# Altium schematic sheet Microcontroller and Memory.SCHDOC
size A3; SheetNumber: 1; SheetTotal: 5
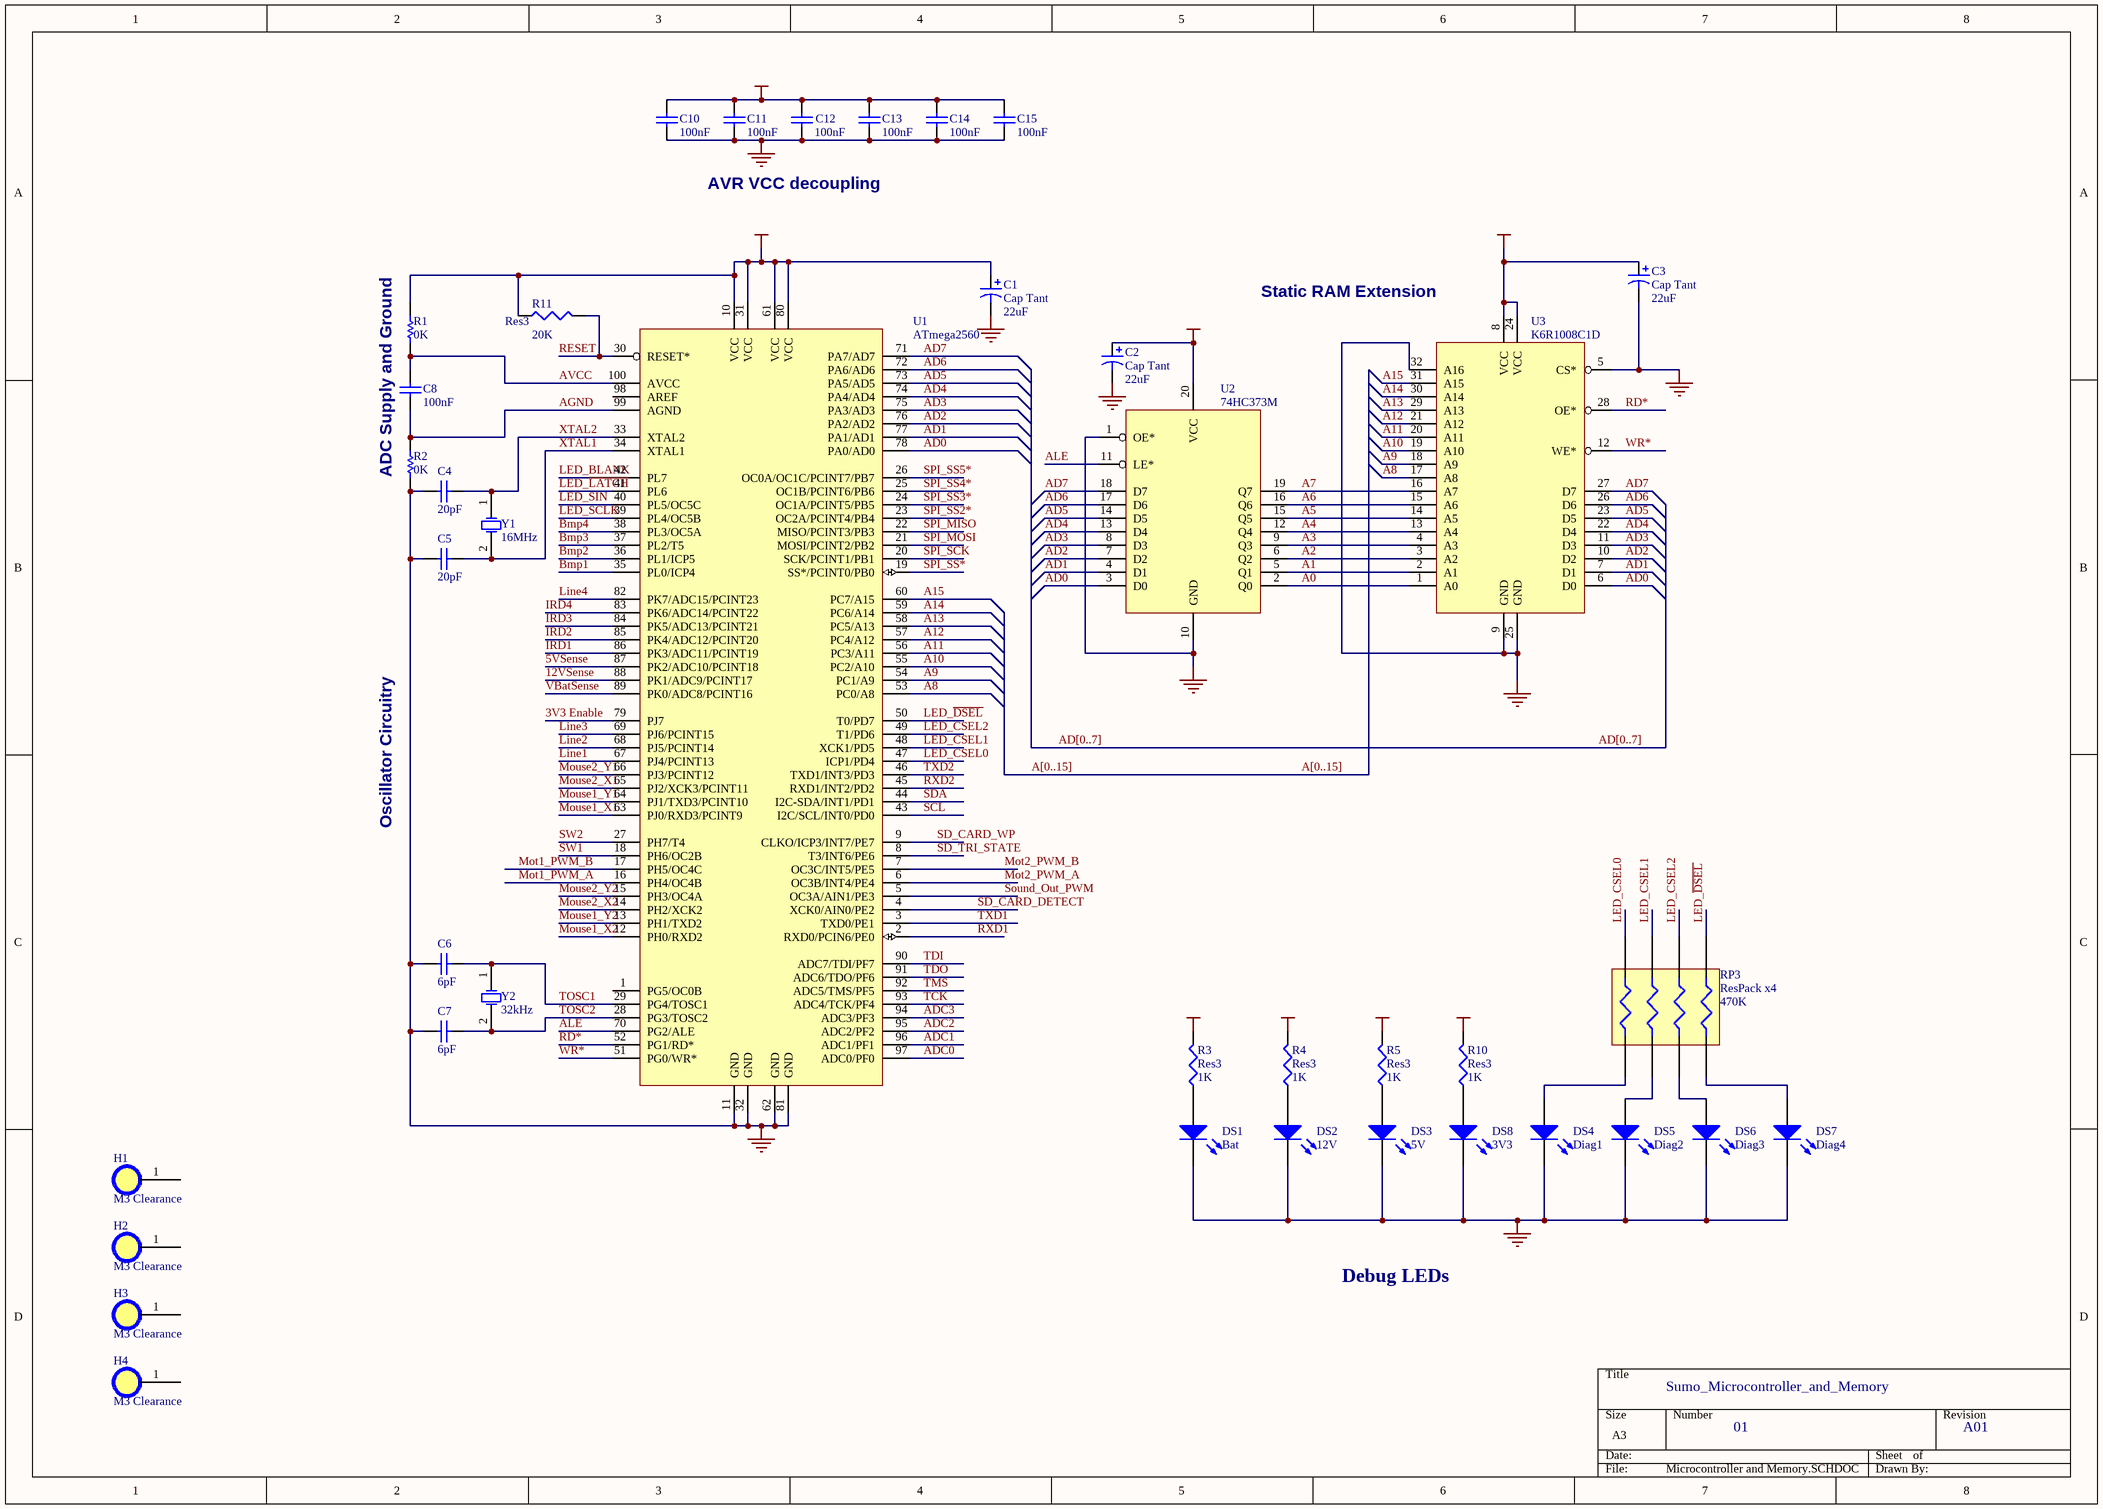
[diagram p0: Microcontroller and Memory.SCHDOC]

## Parts
C1  Cap Tant  value 22uF  [CC4532-1812]
C2  Cap Tant  value 22uF  [CC4532-1812]
C3  Cap Tant  value 22uF  [CC4532-1812]
C4  20pF  [CC2012-0805]
C5  20pF  [CC2012-0805]
C6  6pF  [CC2012-0805]
C7  6pF  [CC2012-0805]
C8  100nF  [CC2012-0805]
C10  value 100nF  [CC2012-0805]  (hidden comment: Cap Semi)
C11  value 100nF  [CC2012-0805]  (hidden comment: Cap Semi)
C12  value 100nF  [CC2012-0805]  (hidden comment: Cap Semi)
C13  value 100nF  [CC2012-0805]  (hidden comment: Cap Semi)
C14  value 100nF  [CC2012-0805]  (hidden comment: Cap Semi)
C15  value 100nF  [CC2012-0805]  (hidden comment: Cap Semi)
DS1  Bat  [SMD _LED]
DS2  12V  [SMD _LED]
DS3  5V  [SMD _LED]
DS4  Diag1  [SMD _LED]
DS5  Diag2  [SMD _LED]
DS6  Diag3  [SMD _LED]
DS7  Diag4  [SMD _LED]
DS8  3V3  [SMD _LED]
H1  M3 Clearance  [M3 Clearance]
H2  M3 Clearance  [M3 Clearance]
H3  M3 Clearance  [M3 Clearance]
H4  M3 Clearance  [M3 Clearance]
R1  0K  [R2012-0805]
R2  0K  [R2012-0805]
R3  Res3  value 1K  [R2012-0805]
R4  Res3  value 1K  [R2012-0805]
R5  Res3  value 1K  [R2012-0805]
R10  Res3  value 1K  [R2012-0805]
R11  Res3  value 20K  [R2012-0805]
RP3  ResPack x4  value 470K  [4x0805 Resistor pack]
U1  ATmega2560  [F-QFP14X14-G100/Z17N]
U2  74HC373M  [SO-G20/Y1.45]
U3  K6R1008C1D  [SO-G32/Y1.45]
Y1  16MHz  [Crystal HC49SLF]
Y2  32kHz  [Crystal CFS206]

## Nets
3V3: R10.2
5V: C1.1 C2.1 C3.1 C10.2 C11.2 C12.2 C13.2 C14.2 C15.2 R1.2 R5.2 R11.1 U1.10(VCC) U1.31(VCC) U1.61(VCC) U1.80(VCC) U2.20(VCC) U3.8(VCC) U3.24(VCC)
12V: R4.2
GND: C1.2 C2.2 C3.2 C4.1 C5.1 C6.1 C7.1 C10.1 C11.1 C12.1 C13.1 C14.1 C15.1 DS1.2(K) DS2.2(K) DS3.2(K) DS4.2(K) DS5.2(K) DS6.2(K) DS7.2(K) DS8.2(K) R2.1 U1.11(GND) U1.32(GND) U1.62(GND) U1.81(GND) U2.1(OE*) U2.10(GND) U3.5(CS*) U3.9(GND) U3.25(GND) U3.32(A16)
VBat: R3.2
3V3 Enable: U1.79(PJ7)
5VSense: U1.87(PK2/ADC10/PCINT18)
12VSense: U1.88(PK1/ADC9/PCINT17)
A0: U2.2(Q0) U3.1(A0)
A1: U2.5(Q1) U3.2(A1)
A2: U2.6(Q2) U3.3(A2)
A3: U2.9(Q3) U3.4(A3)
A4: U2.12(Q4) U3.13(A4)
A5: U2.15(Q5) U3.14(A5)
A6: U2.16(Q6) U3.15(A6)
A7: U2.19(Q7) U3.16(A7)
A8: U1.53(PC0/A8) U3.17(A8)
A9: U1.54(PC1/A9) U3.18(A9)
A10: U1.55(PC2/A10) U3.19(A10)
A11: U1.56(PC3/A11) U3.20(A11)
A12: U1.57(PC4/A12) U3.21(A12)
A13: U1.58(PC5/A13) U3.29(A13)
A14: U1.59(PC6/A14) U3.30(A14)
A15: U1.60(PC7/A15) U3.31(A15)
AD0: U1.78(PA0/AD0) U2.3(D0) U3.6(D0)
AD1: U1.77(PA1/AD1) U2.4(D1) U3.7(D1)
AD2: U1.76(PA2/AD2) U2.7(D2) U3.10(D2)
AD3: U1.75(PA3/AD3) U2.8(D3) U3.11(D3)
AD4: U1.74(PA4/AD4) U2.13(D4) U3.22(D4)
AD5: U1.73(PA5/AD5) U2.14(D5) U3.23(D5)
AD6: U1.72(PA6/AD6) U2.17(D6) U3.26(D6)
AD7: U1.71(PA7/AD7) U2.18(D7) U3.27(D7)
ADC0: U1.97(ADC0/PF0)
ADC1: U1.96(ADC1/PF1)
ADC2: U1.95(ADC2/PF2)
ADC3: U1.94(ADC3/PF3)
AGND: C8.2 R2.2 U1.99(AGND)
ALE: U1.70(PG2/ALE) U2.11(LE*)
AVCC: C8.1 R1.1 U1.100(AVCC)
Bmp1: U1.35(PL0/ICP4)
Bmp2: U1.36(PL1/ICP5)
Bmp3: U1.37(PL2/T5)
Bmp4: U1.38(PL3/OC5A)
IRD1: U1.86(PK3/ADC11/PCINT19)
IRD2: U1.85(PK4/ADC12/PCINT20)
IRD3: U1.84(PK5/ADC13/PCINT21)
IRD4: U1.83(PK6/ADC14/PCINT22)
LED_BLANK: U1.42(PL7)
LED_CSEL0: RP3.8 U1.47(ICP1/PD4)
LED_CSEL1: RP3.7 U1.48(XCK1/PD5)
LED_CSEL2: RP3.6 U1.49(T1/PD6)
LED_~{DSEL}: RP3.5 U1.50(T0/PD7)
LED_~{LATCH}: U1.41(PL6)
LED_SCLK: U1.39(PL4/OC5B)
LED_SIN: U1.40(PL5/OC5C)
Line1: U1.67(PJ4/PCINT13)
Line2: U1.68(PJ5/PCINT14)
Line3: U1.69(PJ6/PCINT15)
Line4: U1.82(PK7/ADC15/PCINT23)
Mot1_PWM_A: U1.16(PH4/OC4B)
Mot1_PWM_B: U1.17(PH5/OC4C)
Mot2_PWM_A: U1.6(OC3B/INT4/PE4)
Mot2_PWM_B: U1.7(OC3C/INT5/PE5)
Mouse1_X1: U1.63(PJ0/RXD3/PCINT9)
Mouse1_X2: U1.12(PH0/RXD2)
Mouse1_Y1: U1.64(PJ1/TXD3/PCINT10)
Mouse1_Y2: U1.13(PH1/TXD2)
Mouse2_X1: U1.65(PJ2/XCK3/PCINT11)
Mouse2_X2: U1.14(PH2/XCK2)
Mouse2_Y1: U1.66(PJ3/PCINT12)
Mouse2_Y2: U1.15(PH3/OC4A)
RD*: U1.52(PG1/RD*) U3.28(OE*)
RESET: R11.2 U1.30(RESET*)
RXD1: U1.2(RXD0/PCIN6/PE0)
RXD2: U1.45(RXD1/INT2/PD2)
SCL: U1.43(I2C/SCL/INT0/PD0)
SD_CARD_DETECT: U1.4(XCK0/AIN0/PE2)
SD_CARD_WP: U1.9(CLKO/ICP3/INT7/PE7)
SD_TRI_STATE: U1.8(T3/INT6/PE6)
SDA: U1.44(I2C-SDA/INT1/PD1)
Sound_Out_PWM: U1.5(OC3A/AIN1/PE3)
SPI_MISO: U1.22(MISO/PCINT3/PB3)
SPI_MOSI: U1.21(MOSI/PCINT2/PB2)
SPI_SCK: U1.20(SCK/PCINT1/PB1)
SPI_SS2*: U1.23(OC2A/PCINT4/PB4)
SPI_SS3*: U1.24(OC1A/PCINT5/PB5)
SPI_SS4*: U1.25(OC1B/PCINT6/PB6)
SPI_SS5*: U1.26(OC0A/OC1C/PCINT7/PB7)
SPI_SS*: U1.19(SS*/PCINT0/PB0)
SW1: U1.18(PH6/OC2B)
SW2: U1.27(PH7/T4)
TCK: U1.93(ADC4/TCK/PF4)
TDI: U1.90(ADC7/TDI/PF7)
TDO: U1.91(ADC6/TDO/PF6)
TMS: U1.92(ADC5/TMS/PF5)
TOSC1: C6.2 U1.29(PG4/TOSC1) Y2.1(OSC1)
TOSC2: C7.2 U1.28(PG3/TOSC2) Y2.2(OSC2)
TXD1: U1.3(TXD0/PE1)
TXD2: U1.46(TXD1/INT3/PD3)
VBatSense: U1.89(PK0/ADC8/PCINT16)
WR*: U1.51(PG0/WR*) U3.12(WE*)
XTAL1: C5.2 U1.34(XTAL1) Y1.2(OSC2)
XTAL2: C4.2 U1.33(XTAL2) Y1.1(OSC1)
NetDS1_1: DS1.1(A) R3.1
NetDS2_1: DS2.1(A) R4.1
NetDS3_1: DS3.1(A) R5.1
NetDS4_1: DS4.1(A) RP3.1
NetDS5_1: DS5.1(A) RP3.2
NetDS6_1: DS6.1(A) RP3.3
NetDS7_1: DS7.1(A) RP3.4
NetDS8_1: DS8.1(A) R10.1

Not connected (* = marked no-connect by the designer): H1 1; H2 1; H3 1; H4 1; U1 1(PG5/OC0B) 98(AREF)

## Buses and harness runs
bus A[0..15]
bus AD[0..7]

## Notes on the sheet
- AVR VCC decoupling
- (near U3) Static RAM Extension
- ADC Supply and Ground
- Oscillator Circuitry
- Debug LEDs
- Sumo_Microcontroller_and_Memory
- 01
- A01

## Library data of the parts
C1-C3 = Cap Pol2: Polarized Capacitor (Axial); Published: 8-Jun-2000; Revision: July-2002: Re-released for DXP Platform.; Publisher: Altium Limited
C4-C8 = Cap: Capacitor; Published: 8-Jun-2000; Revision: July-2002: Re-released for DXP Platform.; Publisher: Altium Limited
C10-C15 = Cap Semi: Capacitor (Semiconductor SIM Model); Published: 8-Jun-2000; Revision: July-2002: Re-released for DXP Platform.; Publisher: Altium Limited
DS1-DS8 = LED3: Typical BLUE SiC LED; Revision 1: Jul-2002: Re-released for DXP Platform.; Revision 2: 17-Dec-2003: PCB Footprint replaced.; Published: 8-Jun-2000; Publisher: Altium Limited
H1-H4 = M3 Clearance hole: 3.2mm ID clearance hole for M3 screw
R1 R2 = Res1: Resistor; Published: 8-Jun-2000; Revision: July-2002: Re-released for DXP Platform.; Publisher: Altium Limited
R3-R5 R10 R11 = Res3: Resistor; Published: 8-Jun-2000; Revision: July-2002: Re-released for DXP Platform.; Publisher: Altium Limited
U1 = ATmega2560: Atmel ATmega2560 MCU
U2 = 74373: Octal 8-bit D-type Latch
U3 = K6R1008C1D: Samsung 128Kx8 High-Speed Static RAM
Y1 Y2 = XTAL: Crystal Oscillator; Published: 8-Jun-2000; Revision: July-2002: Re-released for DXP Platform.; Publisher: Altium Limited